# EAGLE board PlayerBottom (EAGLE 9.6.1), part 1 of 2
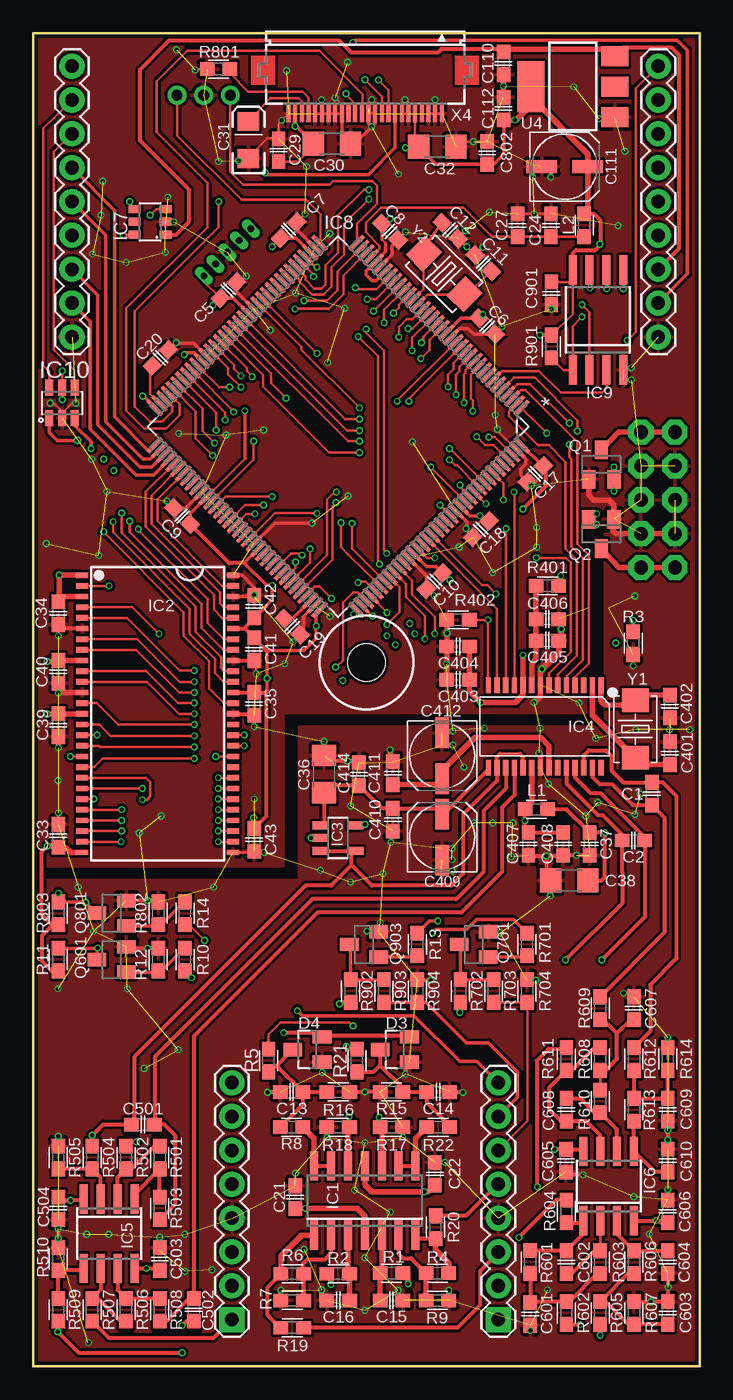
[diagram p2: board, top side]
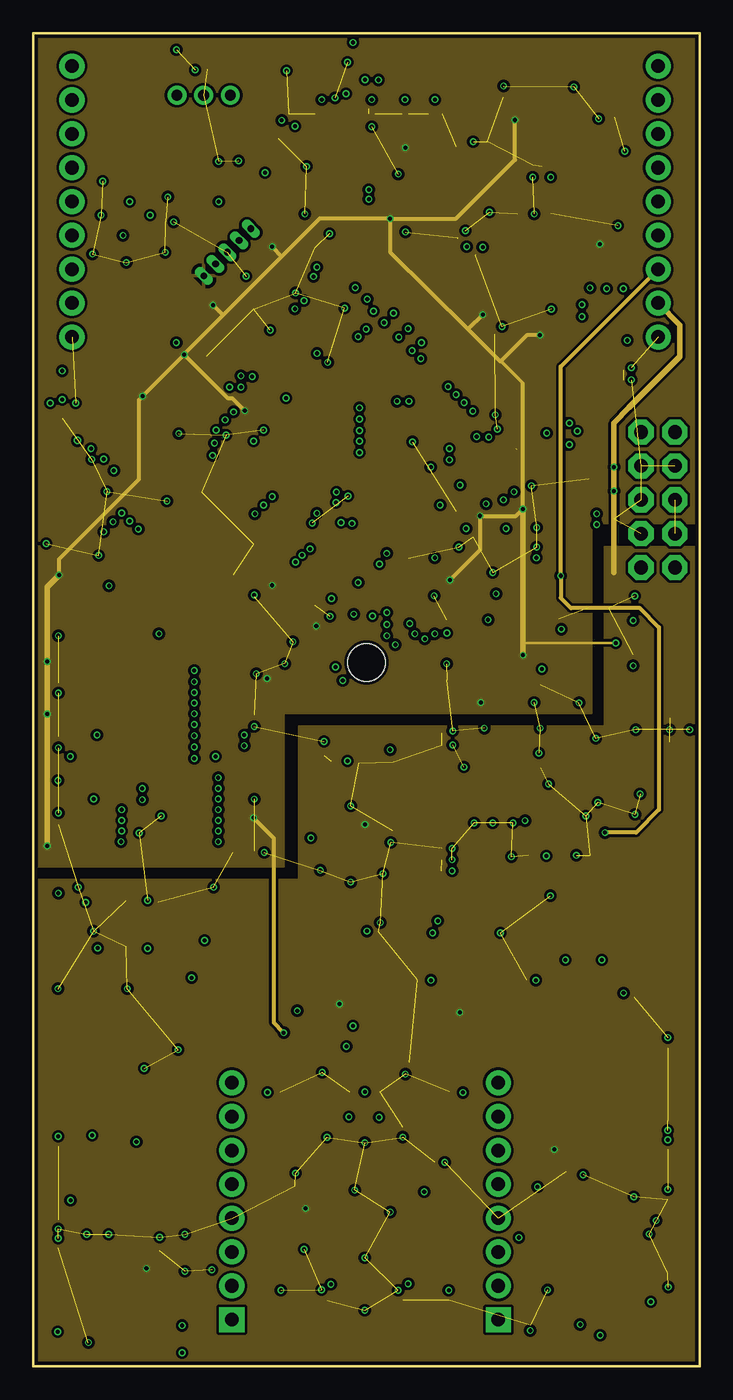
[diagram p3: board, inner layer InnerTop]
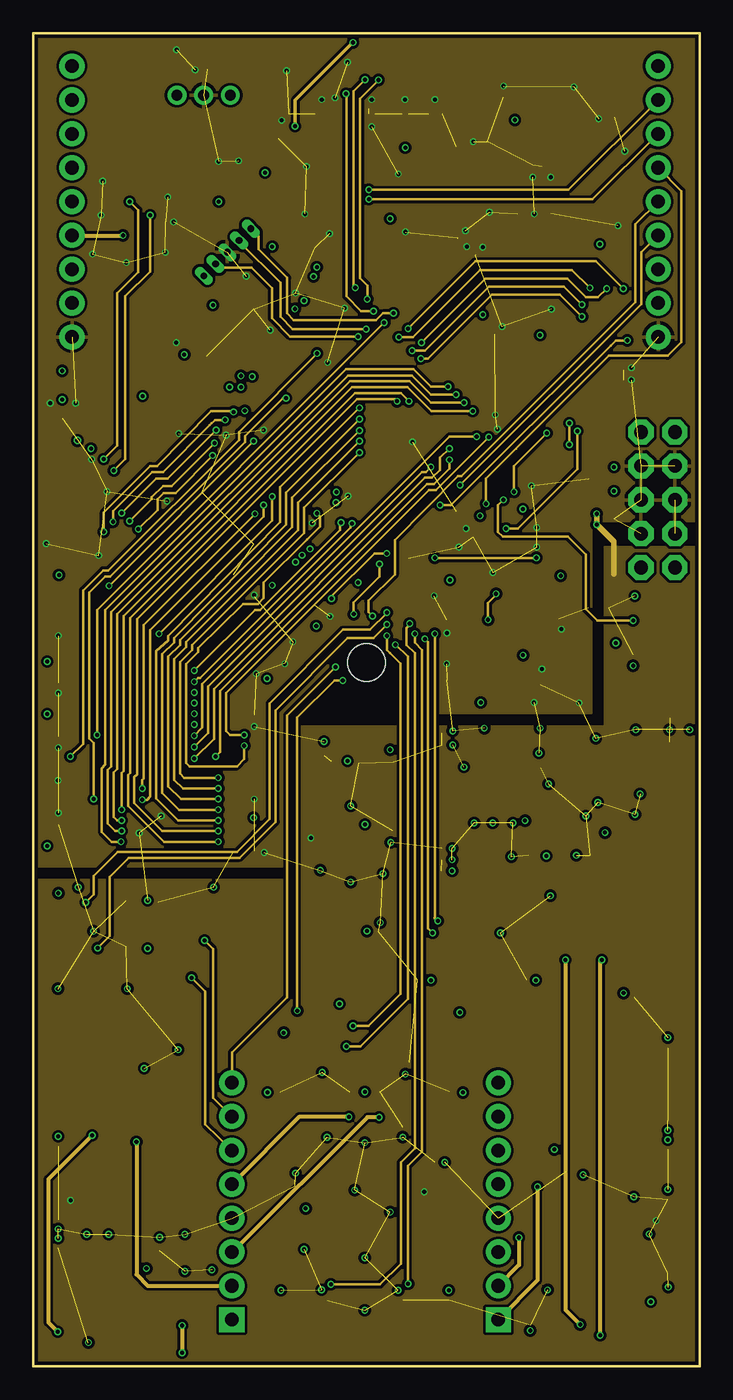
[diagram p4: board, inner layer InnerBottom]
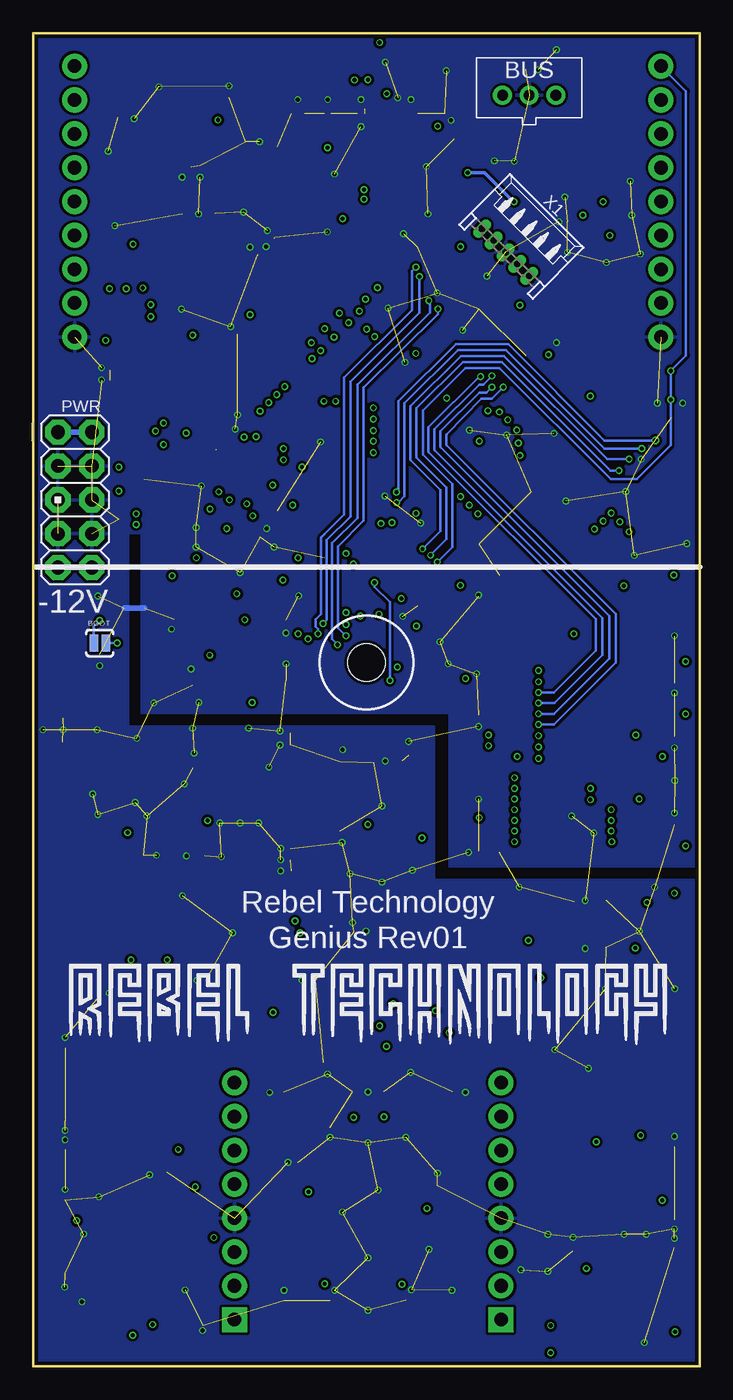
[diagram p5: board, bottom side, seen from below]

Size 50 x 100 mm. Coordinates in mm from the lower left corner, seen from the top.
Outline: 0,0 50,0 50,100 0,100 0,0
Copper layers (1*2*15*16): Top 0.035mm / dielectric 0.2mm / InnerTop 0.0175mm / dielectric 0.3mm / InnerBottom 0.0175mm / dielectric 0.2mm / Bottom 0.035mm
Design rules "SeeedStudio_4layer_DRU_no_angle_20140221": minimum track width 8mil, minimum drill 12mil, track to track 8mil, track to pad 8mil, pad to pad 8mil, via to via 8mil, smd to smd 0mil, copper to edge 10mil, drill to drill 8mil, minimum pad ring 6mil, minimum via ring 4mil, stop-mask expansion 4mil, vias tented up to drill 25mil, thermal gap 10mil
Net classes: 1 power: width 0.178 mm, drill 0.305 mm, clearance 0.178 mm to class 0, clearance 0.178 mm
Holes 2.8 mm at 25,52.79

## Footprints (pad centres in the part's own frame; a part is rotated, then mirrored left to right if it is on the bottom)
SJ_2S-NO = smd 0.635 x 1.27: 1 -0.45,0; 2 0.45,0
JST-B3B-PH-KL = drill 0.8 pad 1.422: 1 2,0; 2 0,0; 3 -2,0
C0603 = smd 1.1 x 1: 1 -0.85,0; 2 0.85,0
C1206 = smd 1.6 x 1.8: 1 -1.4,0; 2 1.4,0
EIA3216 = smd 1.4 x 1.6: A 1.4,0; C -1.4,0
CPOL-5 = smd 2.3 x 1: + 1.725,0; - -1.725,0
SOT23 = smd 1 x 1.4: 1 -0.95,-1.1; 2 0.95,-1.1; 3 0,1.1
SO14 = smd 0.6 x 2.2: 1 -3.81,-2.6; 2 -2.54,-2.6; 3 -1.27,-2.6; 4 0,-2.6; 5 1.27,-2.6; 6 2.54,-2.6; 7 3.81,-2.6; 8 3.81,2.6; 9 2.54,2.6; 10 1.27,2.6; 11 0,2.6; 12 -1.27,2.6; 13 -2.54,2.6; 14 -3.81,2.6
TSOP54-400 = smd 0.4 x 0.9: 1 -10.4,-5.68; 2 -9.6,-5.68; 3 -8.8,-5.68; 4 -8,-5.68; 5 -7.2,-5.68; 6 -6.4,-5.68; 7 -5.6,-5.68; 8 -4.8,-5.68; 9 -4,-5.68; 10 -3.2,-5.68; 11 -2.4,-5.68; 12 -1.6,-5.68; 13 -0.8,-5.68; 14 0,-5.68; 15 0.8,-5.68; 16 1.6,-5.68; 17 2.4,-5.68; 18 3.2,-5.68; 19 4,-5.68; 20 4.8,-5.68; 21 5.6,-5.68; 22 6.4,-5.68; 23 7.2,-5.68; 24 8,-5.68; 25 8.8,-5.68; 26 9.6,-5.68; 27 10.4,-5.68; 28 10.4,5.68; 29 9.6,5.68; 30 8.8,5.68; 31 8,5.68; 32 7.2,5.68; 33 6.4,5.68; 34 5.6,5.68; 35 4.8,5.68; 36 4,5.68; 37 3.2,5.68; 38 2.4,5.68; 39 1.6,5.68; 40 0.8,5.68; 41 0,5.68; 42 -0.8,5.68; 43 -1.6,5.68; 44 -2.4,5.68; 45 -3.2,5.68; 46 -4,5.68; 47 -4.8,5.68; 48 -5.6,5.68; 49 -6.4,5.68; 50 -7.2,5.68; 51 -8,5.68; 52 -8.8,5.68; 53 -9.6,5.68; 54 -10.4,5.68
SOT23-5 = smd 0.6 x 1.2: 1 -0.95,-1.306; 2 0,-1.306; 3 0.95,-1.306; 4 0.95,1.306; 5 -0.95,1.306
TSSOP28-0.65-9.7X4.4MM = smd 0.4 x 1.15: 1 -4.225,-3.1; 2 -3.575,-3.1; 3 -2.925,-3.1; 4 -2.275,-3.1; 5 -1.625,-3.1; 6 -0.975,-3.1; 7 -0.325,-3.1; 8 0.325,-3.1; 9 0.975,-3.1; 10 1.625,-3.1; 11 2.275,-3.1; 12 2.925,-3.1; 13 3.575,-3.1; 14 4.225,-3.1; 15 4.225,3.1; 16 3.575,3.1; 17 2.925,3.1; 18 2.275,3.1; 19 1.625,3.1; 20 0.975,3.1; 21 0.325,3.1; 22 -0.325,3.1; 23 -0.975,3.1; 24 -1.625,3.1; 25 -2.275,3.1; 26 -2.925,3.1; 27 -3.575,3.1; 28 -4.225,3.1
SO08 = smd 0.6 x 2.2: 1 -1.905,-2.6; 2 -0.635,-2.6; 3 0.635,-2.6; 4 1.905,-2.6; 5 1.905,2.6; 6 0.635,2.6; 7 -0.635,2.6; 8 -1.905,2.6
SOT23-6 = smd 0.6 x 0.9: 1 -0.95,-1.15; 2 0,-1.15; 3 0.95,-1.15; 4 0.95,1.15; 5 0,1.15; 6 -0.95,1.15
QFP50P2200X2200X160-144N = smd 1.473 x 0.279: 1 -10.719,8.738; 2 -10.719,8.255; 3 -10.719,7.747; 4 -10.719,7.239; 5 -10.719,6.756; 6 -10.719,6.248; 7 -10.719,5.74; 8 -10.719,5.258; 9 -10.719,4.75; 10 -10.719,4.242; 11 -10.719,3.759; 12 -10.719,3.251; 13 -10.719,2.743; 14 -10.719,2.261; 15 -10.719,1.753; 16 -10.719,1.245; 17 -10.719,0.762; 18 -10.719,0.254; 19 -10.719,-0.254; 20 -10.719,-0.762; 21 -10.719,-1.245; 22 -10.719,-1.753; 23 -10.719,-2.261; 24 -10.719,-2.743; 25 -10.719,-3.251; 26 -10.719,-3.759; 27 -10.719,-4.242; 28 -10.719,-4.75; 29 -10.719,-5.258; 30 -10.719,-5.74; 31 -10.719,-6.248; 32 -10.719,-6.756; 33 -10.719,-7.239; 34 -10.719,-7.747; 35 -10.719,-8.255; 36 -10.719,-8.738; 73 10.719,-8.738; 74 10.719,-8.255; 75 10.719,-7.747; 76 10.719,-7.239; 77 10.719,-6.756; 78 10.719,-6.248; 79 10.719,-5.74; 80 10.719,-5.258; 81 10.719,-4.75; 82 10.719,-4.242; 83 10.719,-3.759; 84 10.719,-3.251; 85 10.719,-2.743; 86 10.719,-2.261; 87 10.719,-1.753; 88 10.719,-1.245; 89 10.719,-0.762; 90 10.719,-0.254; 91 10.719,0.254; 92 10.719,0.762; 93 10.719,1.245; 94 10.719,1.753; 95 10.719,2.261; 96 10.719,2.743; 97 10.719,3.251; 98 10.719,3.759; 99 10.719,4.242; 100 10.719,4.75; 101 10.719,5.258; 102 10.719,5.74; 103 10.719,6.248; 104 10.719,6.756; 105 10.719,7.239; 106 10.719,7.747; 107 10.719,8.255; 108 10.719,8.738 | smd 0.279 x 1.473: 37 -8.738,-10.719; 38 -8.255,-10.719; 39 -7.747,-10.719; 40 -7.239,-10.719; 41 -6.756,-10.719; 42 -6.248,-10.719; 43 -5.74,-10.719; 44 -5.258,-10.719; 45 -4.75,-10.719; 46 -4.242,-10.719; 47 -3.759,-10.719; 48 -3.251,-10.719; 49 -2.743,-10.719; 50 -2.261,-10.719; 51 -1.753,-10.719; 52 -1.245,-10.719; 53 -0.762,-10.719; 54 -0.254,-10.719; 55 0.254,-10.719; 56 0.762,-10.719; 57 1.245,-10.719; 58 1.753,-10.719; 59 2.261,-10.719; 60 2.743,-10.719; 61 3.251,-10.719; 62 3.759,-10.719; 63 4.242,-10.719; 64 4.75,-10.719; 65 5.258,-10.719; 66 5.74,-10.719; 67 6.248,-10.719; 68 6.756,-10.719; 69 7.239,-10.719; 70 7.747,-10.719; 71 8.255,-10.719; 72 8.738,-10.719; 109 8.738,10.719; 110 8.255,10.719; 111 7.747,10.719; 112 7.239,10.719; 113 6.756,10.719; 114 6.248,10.719; 115 5.74,10.719; 116 5.258,10.719; 117 4.75,10.719; 118 4.242,10.719; 119 3.759,10.719; 120 3.251,10.719; 121 2.743,10.719; 122 2.261,10.719; 123 1.753,10.719; 124 1.245,10.719; 125 0.762,10.719; 126 0.254,10.719; 127 -0.254,10.719; 128 -0.762,10.719; 129 -1.245,10.719; 130 -1.753,10.719; 131 -2.261,10.719; 132 -2.743,10.719; 133 -3.251,10.719; 134 -3.759,10.719; 135 -4.242,10.719; 136 -4.75,10.719; 137 -5.258,10.719; 138 -5.74,10.719; 139 -6.248,10.719; 140 -6.756,10.719; 141 -7.239,10.719; 142 -7.747,10.719; 143 -8.255,10.719; 144 -8.738,10.719
SO8W = smd 0.6 x 2.2: 1 -1.905,-3.75; 2 -0.635,-3.75; 3 0.635,-3.75; 4 1.905,-3.75; 5 1.905,3.75; 6 0.635,3.75; 7 -0.635,3.75; 8 -1.905,3.75
SOT-23-6L = smd 0.6 x 1.2: 1 -0.95,-1.15; 2 0,-1.15; 3 0.95,-1.15; 4 0.95,1.15; 5 0,1.15; 6 -0.95,1.15
1X08 = drill 1.016 pad 1.88 square: 1 0,0 | drill 1.016 pad 1.88: 2 2.54,0; 3 5.08,0; 4 7.62,0; 5 10.16,0; 6 12.7,0; 7 15.24,0; 8 17.78,0
1X09 = drill 1.016 pad 1.88: 1 0,0; 2 2.54,0; 3 5.08,0; 4 7.62,0; 5 10.16,0; 6 12.7,0; 7 15.24,0; 8 17.78,0; 9 20.32,0
0603 = smd 1.1 x 1: 1 -0.85,0; 2 0.85,0
AVR_ICSP = drill 1.016 pad 1.88 octagon: 1 -1.27,5.08; 2 1.27,5.08; 3 -1.27,2.54; 4 1.27,2.54; 5 -1.27,0; 6 1.27,0; 7 -1.27,-2.54; 8 1.27,-2.54; 9 -1.27,-5.08; 10 1.27,-5.08
SOT223 = smd 1.5 x 2: 1 -2.3,-3.15; 2 0,-3.15; 3 2.3,-3.15 | smd 3.8 x 2: 4 0,3.15
53048-05 = drill 0.5 pad 0.698 long: 1 2.5,-1.25; 2 1.25,-1.25; 3 0,-1.25; 4 -1.25,-1.25; 5 -2.5,-1.25
FH12-24S-0.5SH = smd 0.3 x 1.3: 1 -5.75,3.25; 2 -5.25,3.25; 3 -4.75,3.25; 4 -4.25,3.25; 5 -3.75,3.25; 6 -3.25,3.25; 7 -2.75,3.25; 8 -2.25,3.25; 9 -1.75,3.25; 10 -1.25,3.25; 11 -0.75,3.25; 12 -0.25,3.25; 13 0.25,3.25; 14 0.75,3.25; 15 1.25,3.25; 16 1.75,3.25; 17 2.25,3.25; 18 2.75,3.25; 19 3.25,3.25; 20 3.75,3.25; 21 4.25,3.25; 22 4.75,3.25; 23 5.25,3.25; 24 5.75,3.25
X2-SMD-5.0X3.2X1.3MM = smd 1.778 x 2.032: 1 -2.159,0; 2 2.159,0

## Placement (x,y rotation side)
BOOT  SOLDERJUMPERNO  [SJ_2S-NO]  45.02,54.25 0 bottom
BUS  [JST-B3B-PH-KL]  12.79,95.36 0 bottom
C1  47n  [C0603]  46.43,42.95 90 top
C2  47n  [C0603]  45.03,39.45 180 top
C5  100n  [C0603]  14.64,80.73 45 top
C6  100n  [C0603]  34.06,78.03 315 top
C7  100n  [C0603]  19.15,85.22 45 top
C8  100n  [C0603]  26.76,85.12 315 top
C9  100n  [C0603]  11.17,63.78 135 top
C10  100n  [C0603]  30.12,58.9 225 top
C11  20p  [C0603]  33.78,82.75 135 top
C12  20p  [C0603]  31.28,85.2 315 top
C13  10n C0G  [C0603]  19.38,20.57 180 top
C14  10n C0G  [C0603]  30.38,20.57 0 top
C15  10n C0G  [C0603]  26.88,4.93 0 top
C16  10n C0G  [C0603]  22.88,4.93 180 top
C17  100n  [C0603]  37.68,66.95 225 top
C18  1u  [C0603]  33.58,62.8 225 top
C19  4u7  [C0603]  19.43,55.5 315 top
C20  4u7  [C0603]  9.53,75.65 45 top
C21  100n  [C0603]  19.66,12.68 90 top
C22  100n  [C0603]  30.13,14.44 90 top
C24  100n  [C0603]  38.84,85.6 90 top
C27  10n  [C0603]  36.34,85.6 90 top
C29  100n  [C0603]  18.4,91.23 270 top
C30  10u  [C1206]  22.4,91.73 180 top
C31  4u7 16V Tantalum  [EIA3216]  16.15,92 90 top
C32  10u  [C1206]  30.32,91.48 180 top
C33  100n  [C0603]  1.88,39.8 90 top
C34  100n  [C0603]  1.88,56.5 270 top
C35  100n  [C0603]  16.58,49.7 270 top
C36  10u  [C1206]  21.83,44.42 270 top
C37  100n  [C0603]  41.76,39.18 270 top
C38  10u  [C1206]  40.21,36.43 180 top
C39  100n  [C0603]  1.88,48.1 270 top
C40  100n  [C0603]  1.88,52.1 270 top
C41  100n  [C0603]  16.58,53.8 270 top
C42  100n  [C0603]  16.58,57 90 top
C43  100n  [C0603]  16.58,39.5 270 top
C110  100n  [C0603]  35.3,97.75 90 top
C111  47u  [CPOL-5]  39.88,90 0 top
C112  100n  [C0603]  35.3,94.35 90 top
C401  39p C0G  [C0603]  47.78,46 90 top
C402  39p C0G  [C0603]  47.78,49.5 270 top
C403  1u  [C0603]  31.88,51.5 180 top
C404  100n  [C0603]  31.88,54 180 top
C405  100n  [C0603]  38.58,54.43 0 top
C406  1u  [C0603]  38.58,56.05 0 top
C407  1u  [C0603]  37.16,39.18 270 top
C408  100n  [C0603]  39.76,39.18 270 top
C409  10u  [CPOL-5]  30.68,39.7 90 top
C410  100n  [C0603]  26.98,41 270 top
C411  100n  [C0603]  26.98,44.5 90 top
C412  47u  [CPOL-5]  30.68,45.8 270 top
C414  100n  [C0603]  24.44,44.42 90 top
C501  2n7 C0G  [C0603]  8.22,18.13 180 top
C502  2n7 C0G  [C0603]  12.04,4.23 270 top
C503  100n  [C0603]  9.5,8.04 90 top
C504  100n  [C0603]  1.88,11.85 270 top
C601  1n C0G  [C0603]  37.29,3.92 90 top
C602  100p C0G  [C0603]  40,7.81 90 top
C603  1n C0G  [C0603]  47.62,4 90 top
C604  100p C0G  [C0603]  47.62,7.81 270 top
C605  100n  [C0603]  39.98,15.42 270 top
C606  100n  [C0603]  47.62,11.62 90 top
C607  1n C0G  [C0603]  45.08,26.86 270 top
C608  100p C0G  [C0603]  40,19.24 270 top
C609  1n C0G  [C0603]  47.62,19.24 270 top
C610  100p C0G  [C0603]  47.62,15.43 90 top
C802  100n  [C0603]  34.06,91.03 270 top
C901  100n  [C0603]  38.88,80.5 270 top
D3  BAT54S  [SOT23]  27.13,23.76 90 top
D4  BAT54S  [SOT23]  20.57,23.76 90 top
IC1  TL074D  [SO14]  24.88,12.44 0 top
IC2  IS42S16400J  [TSOP54-400]  9.33,48.95 270 top
IC3  LM321MF  [SOT23-5]  22.86,39.62 270 top
IC4  CS4271  [TSSOP28-0.65-9.7X4.4MM]  38.38,48 180 top
IC5  NE5532D  [SO08]  5.69,9.95 180 top
IC6  NE5532D  [SO08]  43.18,13.52 0 top
IC7  MIC2005  [SOT23-6]  8.76,85.85 90 top
IC8  STM32H743ZGTx  [QFP50P2200X2200X160-144N]  22.88,70.5 225 top
IC9  N25Q128A13  [SO8W]  42.38,78.5 0 top
IC10  USBLC6-2SC6  [SOT-23-6L]  2.16,72.26 0 top
JP1  [1X08]  14.9,3.49 90 top
JP2  M09  [1X09]  2.9,97.54 270 top
JP3  [1X08]  34.9,3.49 90 top
JP4  M09  [1X09]  46.9,97.54 270 top
L1  1uH  [0603]  37.76,41.78 180 top
L2  1uH  [0603]  41.34,85.6 90 top
PWR  M05X2PTH  [AVR_ICSP]  46.88,65 0 bottom
Q1  SI2309CDS  [SOT23]  42.63,67.65 0 top
Q2  2N7002P  [SOT23]  42.63,62.45 180 top
Q601  BC846  [SOT23]  5.88,30.5 90 top
Q701  BC846  [SOT23]  33.05,31.64 90 top
Q801  BC846  [SOT23]  5.88,33.99 90 top
Q903  BC846  [SOT23]  24.82,31.64 90 top
R1  2k  [0603]  26.88,6.99 180 top
R2  2k  [0603]  22.88,6.93 0 top
R3  10k  [0603]  45.02,54.25 90 top
R4  20k  [0603]  30.33,6.99 0 top
R5  100R  [0603]  17.65,22.93 90 top
R6  20k  [0603]  19.43,6.93 180 top
R7  10k  [0603]  19.43,4.93 0 top
R8  2k  [0603]  19.38,17.93 180 top
R9  10k  [0603]  30.33,4.93 180 top
R10  100k  [0603]  11.38,30.5 90 top
R11  10k  [0603]  1.88,30.5 90 top
R12  1M  [0603]  9.38,30.5 90 top
R13  1k  [0603]  28.82,31.64 90 top
R14  100k  [0603]  11.38,33.99 90 top
R15  1k  [0603]  26.88,20.57 180 top
R16  1k  [0603]  22.88,20.57 0 top
R17  100k  [0603]  26.88,17.93 180 top
R18  100k  [0603]  22.88,17.93 0 top
R19  100R  [0603]  19.43,2.88 0 top
R20  100R  [0603]  30.19,10.44 90 top
R21  100R  [0603]  24.29,22.93 90 top
R22  2k  [0603]  30.38,17.93 0 top
R401  5R1  [0603]  38.58,58.55 0 top
R402  10k  [0603]  31.88,56 0 top
R501  22k  [0603]  9.5,15.66 270 top
R502  100k  [0603]  6.96,15.66 270 top
R503  100R  [0603]  9.5,11.85 270 top
R504  22k  [0603]  4.42,15.66 270 top
R505  100k  [0603]  1.88,15.66 90 top
R506  22k  [0603]  6.96,4.23 90 top
R507  100k  [0603]  4.42,4.23 90 top
R508  100R  [0603]  9.5,4.23 270 top
R509  22k  [0603]  1.88,4.23 90 top
R510  100k  [0603]  1.88,8.04 90 top
R601  10k  [0603]  37.29,7.82 270 top
R602  4k7  [0603]  40,4 270 top
R603  4k7  [0603]  42.54,7.81 270 top
R604  100R  [0603]  40,11.62 270 top
R605  4k7  [0603]  42.54,4 270 top
R606  4k7  [0603]  45.08,7.81 270 top
R607  10k  [0603]  45.08,4 90 top
R608  10k  [0603]  42.54,23.05 270 top
R609  4k7  [0603]  42.54,26.86 90 top
R610  4k7  [0603]  42.54,19.87 90 top
R611  100R  [0603]  40,23.05 270 top
R612  4k7  [0603]  45.08,23.05 90 top
R613  4k7  [0603]  45.08,19.24 90 top
R614  10k  [0603]  47.62,23.05 90 top
R701  1k  [0603]  37.05,31.64 90 top
R702  1k  [0603]  32.05,28.14 270 top
R703  100R  [0603]  34.55,28.14 270 top
R704  1k  [0603]  37.05,28.14 270 top
R801  560k  [0603]  13.9,97.32 0 top
R802  1M  [0603]  9.38,33.99 90 top
R803  10k  [0603]  1.88,33.99 90 top
R901  10k  [0603]  38.88,76.5 270 top
R902  1k  [0603]  23.82,28.14 90 top
R903  100R  [0603]  26.32,28.14 270 top
R904  1k  [0603]  28.82,28.14 270 top
U4  TLV1117LV  [SOT223]  40.49,96 90 top
X1  53048-05  [53048-05]  13.68,84.46 315 bottom
X4  FH12-24S-0.5SH  [FH12-24S-0.5SH]  24.9,97.23 180 top
Y1  24.576MHz  [X2-SMD-5.0X3.2X1.3MM]  45.18,47.8 270 top
Y2  25MHz  [X2-SMD-5.0X3.2X1.3MM]  30.83,81.95 315 top